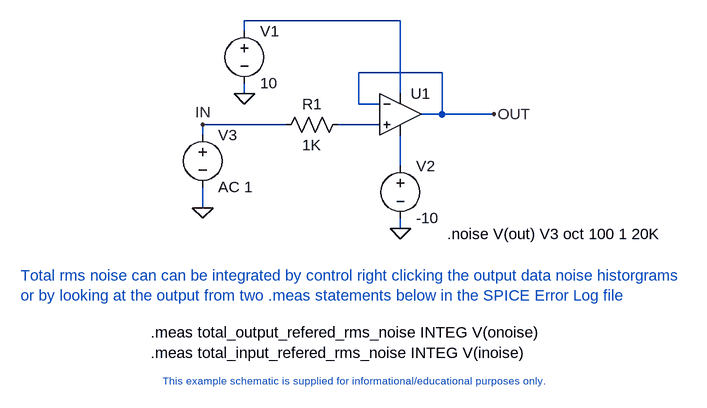
[diagram p0: schematic opampnoise.asc]
opampnoise.asc, the LTspice schematic file:
Version 4
SHEET 1 2344 1928
WIRE 1328 1152 1088 1152
WIRE 1088 1168 1088 1152
WIRE 1392 1232 1264 1232
WIRE 1088 1264 1088 1248
WIRE 1328 1264 1328 1152
WIRE 1264 1280 1264 1232
WIRE 1296 1280 1264 1280
WIRE 1392 1296 1392 1232
WIRE 1392 1296 1360 1296
WIRE 1472 1296 1392 1296
WIRE 1152 1312 1024 1312
WIRE 1296 1312 1232 1312
WIRE 1024 1328 1024 1312
WIRE 1328 1376 1328 1328
WIRE 1024 1440 1024 1408
WIRE 1328 1472 1328 1456
FLAG 1088 1264 0
FLAG 1328 1472 0
FLAG 1024 1440 0
FLAG 1024 1312 IN
FLAG 1472 1296 OUT
SYMBOL VOLTAGE 1088 1152 R0
SYMATTR InstName V1
SYMATTR Value 10
SYMBOL voltage 1328 1360 R0
SYMATTR InstName V2
SYMATTR Value -10
SYMBOL voltage 1024 1312 R0
SYMATTR InstName V3
SYMATTR Value AC 1
SYMBOL opamps\\universalopamp 1328 1296 R0
SYMATTR InstName U1
SYMATTR SpiceLine2 en=1n enk=5 in=0 ink=0 Rin=500Meg
SYMBOL res 1248 1296 R90
WINDOW 0 0 56 VBottom 2
WINDOW 3 32 56 VTop 2
SYMATTR InstName R1
SYMATTR Value 1K
TEXT 1248 1696 Top 1 ;This example schematic is supplied for informational/educational purposes only.
TEXT 1400 1480 Left 2 !.noise V(out) V3 oct 100 1 20K
TEXT 744 1544 Left 2 ;Total rms noise can can be integrated by control right clicking the output data noise historgrams\nor by looking at the output from two .meas statements below in the SPICE Error Log file
TEXT 944 1632 Left 2 !.meas total_output_refered_rms_noise INTEG V(onoise)\n.meas total_input_refered_rms_noise INTEG V(inoise)

The netlist it stands for:
* opampnoise.asc
V1 N001 0 10
V2 N003 0 -10
V3 IN 0 AC 1
XU1 N002 OUT N001 N003 OUT level1 Avol=1Meg GBW=10Meg Vos=0 En=0 Enk=0 In=0 Ink=0 Rin=500Meg en=1n enk=5 in=0 ink=0 Rin=500Meg  ; pins In+ In- V+ V- OUT
R1 N002 IN 1K
* This example schematic is supplied for informational/educational purposes only.
.noise V(out) V3 oct 100 1 20K
* Total rms noise can can be integrated by control right clicking the output data noise historgrams
* or by looking at the output from two .meas statements below in the SPICE Error Log file
.meas total_output_refered_rms_noise INTEG V(onoise)
.meas total_input_refered_rms_noise INTEG V(inoise)
.lib UniversalOpAmp1.lib
.backanno
.end